# EAGLE design DualMonoPSU (EAGLE 9.6.2)
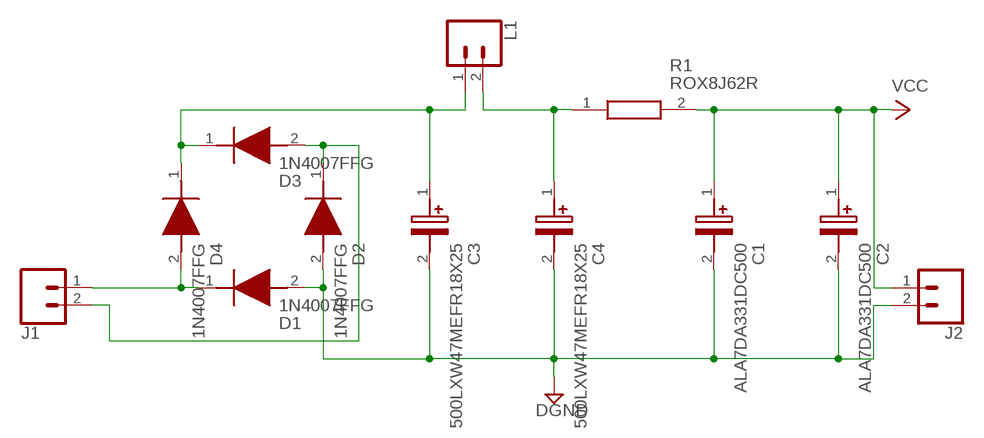
[diagram p0: schematic, sheet 1]

## Parts
C1  ALA7DA331DC500  [ALA7DA331DC500]
C2  ALA7DA331DC500  [ALA7DA331DC500]
C3  500LXW47MEFR18X25  [CAPPRD750W80D1825H2700]
C4  500LXW47MEFR18X25  [CAPPRD750W80D1825H2700]
D1  1N4007FFG  [DIOAD1405W86L465D235]
D2  1N4007FFG  [DIOAD1405W86L465D235]
D3  1N4007FFG  [DIOAD1405W86L465D235]
D4  1N4007FFG  [DIOAD1405W86L465D235]
J1  CONN_025MM  [SCREWTERMINAL-5MM-2]
J2  CONN_025MM  [SCREWTERMINAL-5MM-2]
L1  CONN_025MM  [SCREWTERMINAL-5MM-2]
R1  ROX8J62R  [RESAD7500W80L4100D850]

## Nets
DGND: C1.2(-) C2.2(-) C3.2(-) C4.2(-) D1.2(A) D2.2(A) J2.2
N$2: D1.1(K) D4.2(A) J1.1
N$3: C3.1(+) D3.1(K) D4.1(K) L1.1
N$4: D2.1(K) D3.2(A) J1.2
N$5: C4.1(+) L1.2 R1.1
VCC: C1.1(+) C2.1(+) J2.1 R1.2

## Library data of the parts
C1 C2 = ALA7DA331DC500:ALA7DA331DC500: ALA7D, Aluminum, Aluminum Electrolytic, 330 uF, 20%, 500 VDC, -40/+85C, 85C, -40C, 85C, 2, 15,000 Hrs, 574 mOhms, 2.037, 990 uA, 60 g, 35mm, 35mm, 10mm, 6.3mm, 100, 156 Weeks Source: Datasheet <https://search.kemet.com/component-documentation/download/specsheet/ALA7DA331DC500>; DESCRIPTION: ALA7D, Aluminum, Aluminum Electrolytic, 330 uF, 20%, 500 VDC, -40/+85C, 85C, -40C, 85C, 2, 15,000 Hrs, 574 mOhms, 2.037, 990 uA, 60 g, 35mm, 35mm, 10mm, 6.3mm, 100, 156 Weeks; HEIGHT: 37mm; MANUFACTURER_NAME: KEMET; MANUFACTURER_PART_NUMBER: ALA7DA331DC500; MOUSER_PART_NUMBER: 80-ALA7DA331DC500; MOUSER_PRICE-STOCK: https://www.mouser.co.uk/ProductDetail/KEMET/ALA7DA331DC500?qs=vdi0iO8H4N1O5rCxmNqCxw%3D%3D
C3 C4 = 500LXW47MEFR18X25:500LXW47MEFR18X25: Aluminum Electrolytic Capacitors - Radial Leaded GENERAL PURPOSE ELECTROLYTIC CAPACITORS Source: Datasheet <https://www.mouser.com/datasheet/2/977/e_LXW-1600626.pdf>; DESCRIPTION: Aluminum Electrolytic Capacitors - Radial Leaded GENERAL PURPOSE ELECTROLYTIC CAPACITORS; HEIGHT: 27mm; MANUFACTURER_NAME: Rubycon; MANUFACTURER_PART_NUMBER: 500LXW47MEFR18X25; MOUSER_PART_NUMBER: 232-500LXW47MEFR18X2; MOUSER_PRICE-STOCK: https://www.mouser.co.uk/ProductDetail/Rubycon/500LXW47MEFR18X25?qs=T3oQrply3y%2FbY1bh%2FMUwZw%3D%3D
D1-D4 = 1N4007FFG:1N4007FFG: Rectifiers 1000V 1A Standard Source: Datasheet <http://www.onsemi.com/pub_link/Collateral/1N4001-D.PDF>; DESCRIPTION: Rectifiers 1000V 1A Standard; HEIGHT: mm; MANUFACTURER_NAME: onsemi; MANUFACTURER_PART_NUMBER: 1N4007FFG; MOUSER_PART_NUMBER: 863-1N4007FFG; MOUSER_PRICE-STOCK: https://www.mouser.co.uk/ProductDetail/onsemi/1N4007FFG?qs=y2kkmE52mdPFE87Rxbyfgw%3D%3D
J1 J2 L1 = SparkFun-Connectors:CONN_02: Multi connection point. Often used as Generic Header-pin footprint for 0.1 inch spaced/style header connections On any of the 0.1 inch spaced packages, you can populate with these: Break Away Headers - Straight <https://www.sparkfun.com/products/116> (PRT-00116) Break Away Male Headers - Right Angle <https://www.sparkfun.com/products/553> (PRT-00553) Female Headers <https://www.sparkfun.com/products/115> (PRT-00115) Break Away Headers - Machine Pin <https://www.sparkfun.com/products/117> (PRT-00117) Break Away Female Headers - Swiss Machine Pin <https://www.sparkfun.com/products/743> (PRT-00743) For SCREWTERMINALS and SPRING TERMINALS visit here: Screw Terimnals on SparkFun.com <https://www.sparkfun.com/search/results?term=Screw+Terminals> (5mm/3.5mm/2.54mm spacing) This device is also useful as a general connection point to wire up your design to another part of your project. Our various solder wires solder well into these plated through hole pads. Hook-Up Wire - Assortment (Stranded, 22 AWG) <https://www.sparkfun.com/products/11375> (PRT-11375) Hook-Up Wire - Assortment (Solid Core, 22 AWG) <https://www.sparkfun.com/products/11367> (PRT-11367) View the entire wire category on our website here <https://www.sparkfun.com/categories/141> Special notes: Molex polarized connector foot print use with: PRT-08233 with associated crimp pins and housings. 2.54_SCREWTERM for use with PRT-10571. 3.5mm Screw Terminal footprints for PRT-08084 5mm Screw Terminal footprints for use with PRT-08432; SF_SKU: PRT-08432
R1 = ROX8J62R:ROX8J62R: NEOHM - TE CONNECTIVITY - ROX8J62R - Through Hole Resistor, Flame Proof, 62 ohm, ROX, 8 W, +/- 5%, Axial Leaded, 750 V Source: Datasheet <https://www.mouser.com/datasheet/2/418/9/ENG_DS_1773271_J-1533800.pdf>; DESCRIPTION: NEOHM - TE CONNECTIVITY - ROX8J62R - Through Hole Resistor, Flame Proof, 62 ohm, ROX, 8 W, +/- 5%, Axial Leaded, 750 V; HEIGHT: mm; MANUFACTURER_NAME: TE Connectivity; MANUFACTURER_PART_NUMBER: ROX8J62R

## Net classes
3 Power: width 1.27 mm, drill 1.27 mm, clearance 0.254 mm

## Board
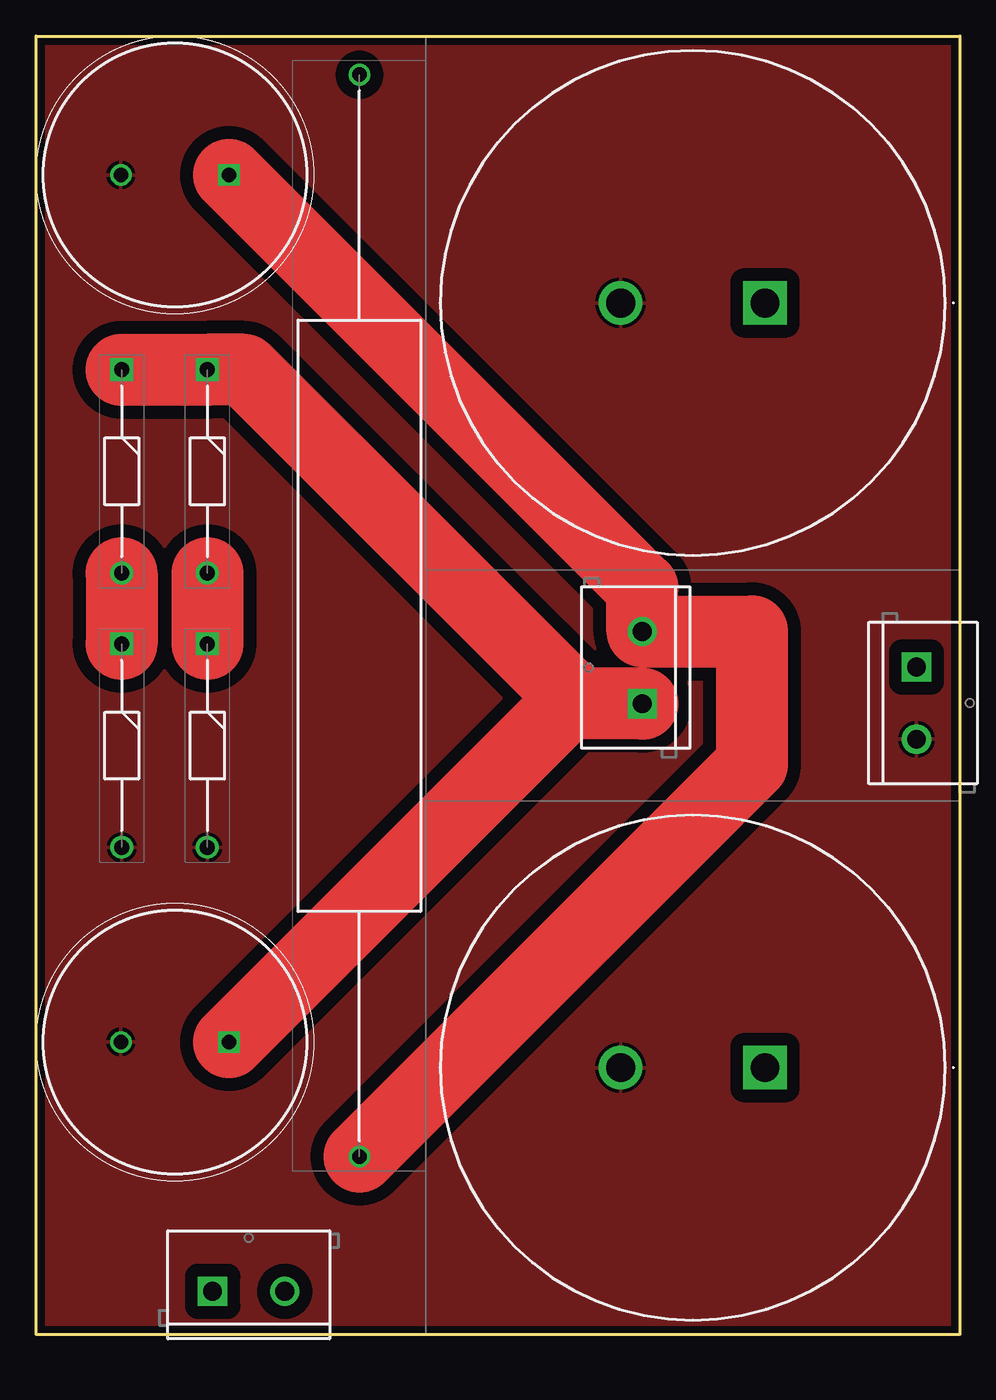
[diagram p1: board, top side]
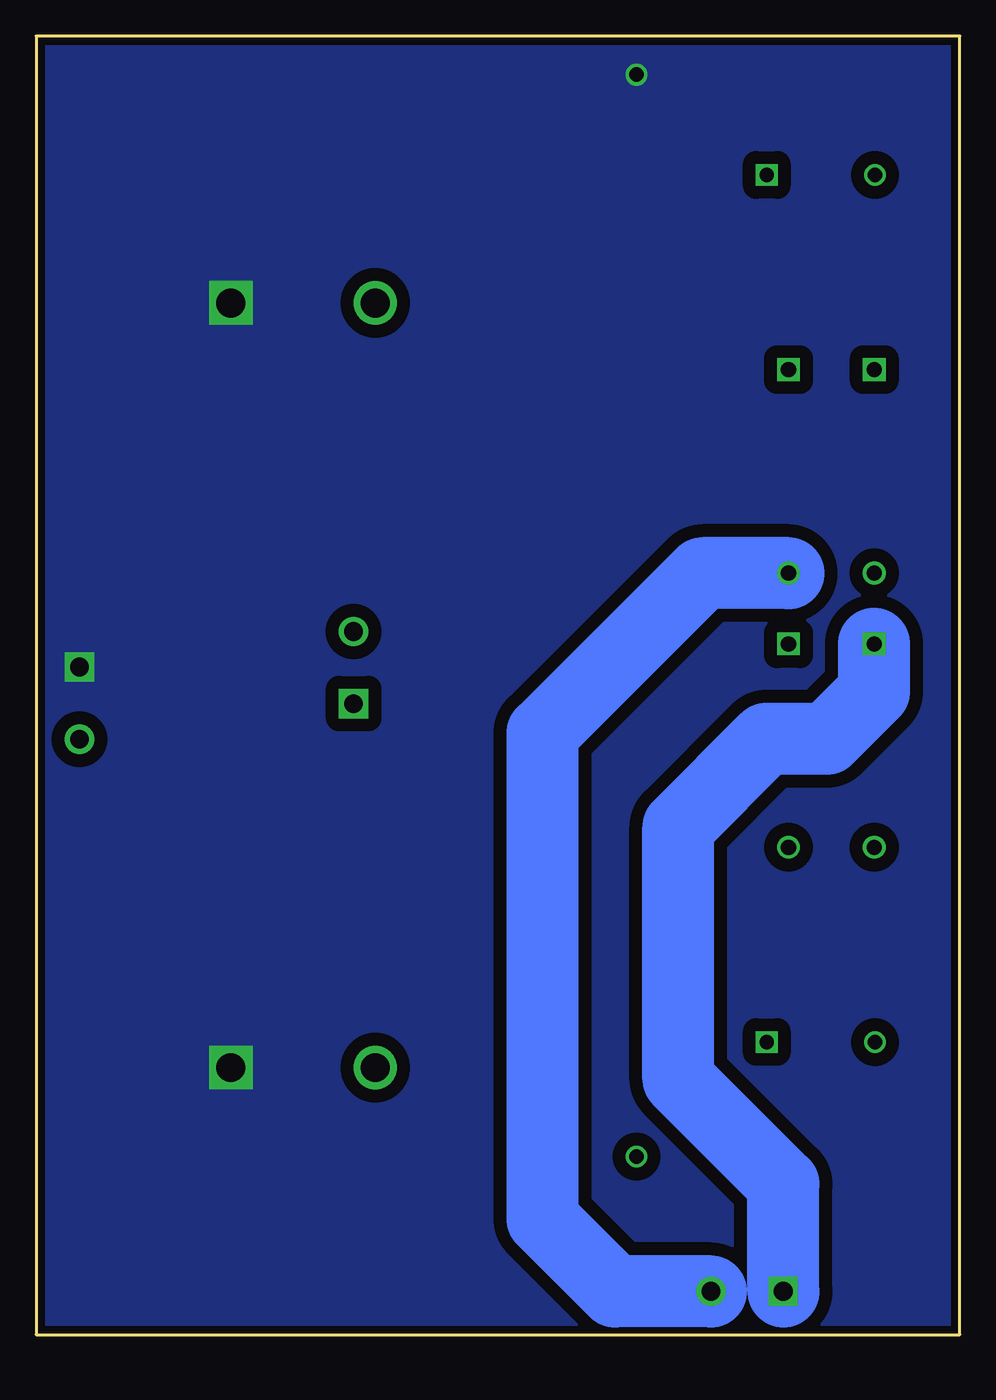
[diagram p2: board, bottom side, seen from below]

Size 64 x 90 mm. Coordinates in mm from the lower left corner, seen from the top.
Outline: 0,0 0,90 64,90 64,0 0,0
Copper layers (1*16): Top 0.035mm / dielectric 1.6mm / Bottom 0.035mm
Design rules "Elecrow_2-layer_PCB_eagle_rule *": minimum track width 5mm, minimum drill 12mil, track to track 0.9mm, track to pad 0.9mm, pad to pad 0.9mm, via to via 0.9mm, smd to smd 0mil, copper to edge 20mil, drill to drill 10mil, minimum pad ring 6mil, minimum via ring 6mil, stop-mask expansion 0mil, vias tented up to drill 100mil, thermal gap 10mil

### Footprints (pad centres in the part's own frame; a part is rotated, then mirrored left to right if it is on the bottom)
ALA7DA331DC500 = drill 2 pad 3 square: 1 0,0 | drill 2 pad 3: 2 10,0
CAPPRD750W80D1825H2700 = drill 1 pad 1.5 square: 1 0,0 | drill 1 pad 1.5: 2 7.5,0
DIOAD1405W86L465D235 = drill 1.05 pad 1.575 square: 1 0,0 | drill 1.05 pad 1.575: 2 14.1,0
SCREWTERMINAL-5MM-2 = drill 1.3 pad 2.032 square: 1 0,0 | drill 1.3 pad 2.032: 2 5,0
RESAD7500W80L4100D850 = drill 1 pad 1.5: 1 0,0; 2 75,0

### Placement (x,y rotation side)
C1  50.5,71.5 180 top
C2  50.5,18.5 180 top
C3  13.38,20.27 180 top
C4  13.38,80.38 180 top
D1  5.93,47.87 270 top
D2  11.87,47.87 270 top
D3  11.87,66.88 270 top
D4  5.93,66.88 270 top
J1  12.23,3 0 top
J2  61,46.27 270 top
L1  42,43.73 90 top
R1  22.4,12.32 90 top

### Tracks (layer width: path | path; a pad name or v marks a point on that pad's centre or on a via)
DGND
  pour Top (rank 6): 64,0 0,0 0,90 64,90
N$2
  Top 5: D4.2 D1.1
  Bottom 5: J1.1 12.23,10.43 19.5,17.7 19.5,35.2 13.4,41.3 9.2,41.3 5.93,44.57 D1.1
N$3
  Top 5: D4.1 D3.1 14.42,66.88 37.57,43.73 | L1.1 37.57,43.73 | C3.1 36.83,43.73 37.57,43.73
N$4
  Top 5: D3.2 D2.1
  Bottom 5: D3.2 17.82,52.78 28.9,41.7 28.9,8 23.9,3 J1.2
N$5
  Top 5: C4.1 42,51.75 L1.2 49.6,48.73 49.6,39.52 R1.1
VCC
  pour Bottom (rank 6, no thermals): 64,0 0,0 0,90 64,90